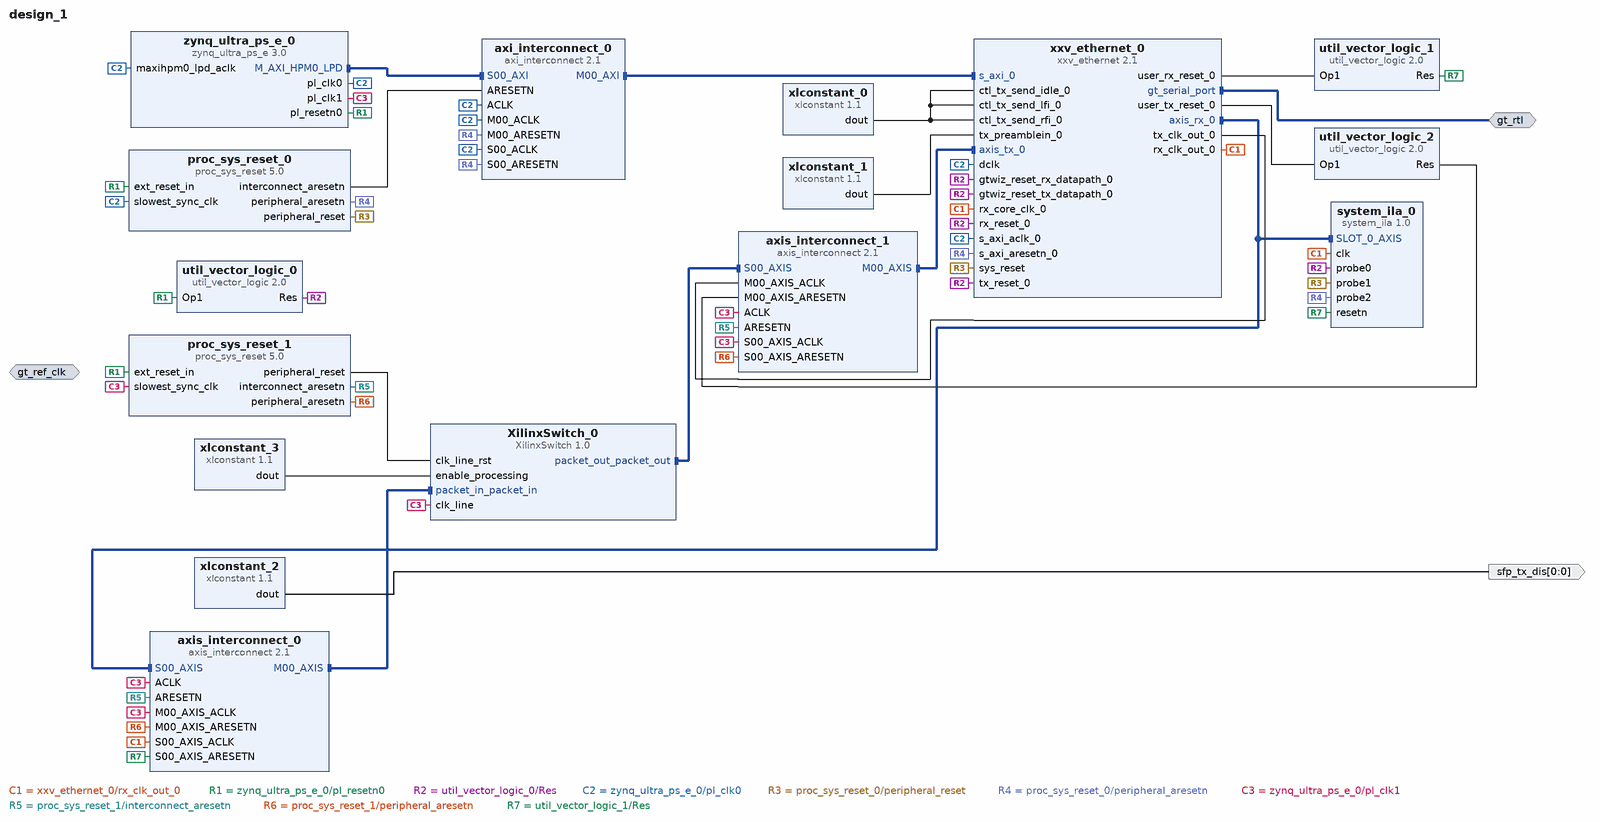
[diagram p0: block diagram of the top level]
# Vivado block design design_1, xczu9eg-ffvb1156-2-i, Vivado 2017.1_sdx
create_bd_design design_1

create_bd_intf_port -mode Master -vlnv xilinx.com:interface:gt_rtl:1.0 gt_rtl
create_bd_intf_port -mode Slave -vlnv xilinx.com:interface:diff_clock_rtl:1.0 gt_ref_clk
set_property -dict {CONFIG.FREQ_HZ 156250000} [get_bd_intf_ports gt_ref_clk]
create_bd_port -dir O -from 0 -to 0 sfp_tx_dis

create_bd_cell -type ip -vlnv xilinx.com:sdnet:XilinxSwitch:1.0 XilinxSwitch_0
create_bd_cell -type ip -vlnv xilinx.com:ip:xxv_ethernet:2.1 xxv_ethernet_0
set_property -dict [list \
  CONFIG.BASE_R_KR BASE-R \
  CONFIG.USE_BOARD_FLOW true \
  CONFIG.DIFFCLK_BOARD_INTERFACE user_si570_sysclk \
] [get_bd_cells xxv_ethernet_0]
create_bd_cell -type ip -vlnv xilinx.com:ip:xlconstant:1.1 xlconstant_0
set_property -dict {CONFIG.CONST_WIDTH 1 CONFIG.CONST_VAL 0} [get_bd_cells xlconstant_0]
create_bd_cell -type ip -vlnv xilinx.com:ip:zynq_ultra_ps_e:3.0 zynq_ultra_ps_e_0
set_property -dict {CONFIG.PSU__FPGA_PL1_ENABLE 1 CONFIG.PSU__CRL_APB__PL1_REF_CTRL__FREQMHZ 200} [get_bd_cells zynq_ultra_ps_e_0]
create_bd_cell -type ip -vlnv xilinx.com:ip:util_vector_logic:2.0 util_vector_logic_0
set_property -dict {CONFIG.C_SIZE 1 CONFIG.C_OPERATION not} [get_bd_cells util_vector_logic_0]
create_bd_cell -type ip -vlnv xilinx.com:ip:proc_sys_reset:5.0 proc_sys_reset_0
create_bd_cell -type ip -vlnv xilinx.com:ip:xlconstant:1.1 xlconstant_1
set_property -dict {CONFIG.CONST_WIDTH 56 CONFIG.CONST_VAL 0} [get_bd_cells xlconstant_1]
create_bd_cell -type ip -vlnv xilinx.com:ip:axis_interconnect:2.1 axis_interconnect_0
set_property -dict {CONFIG.NUM_MI 1} [get_bd_cells axis_interconnect_0]
create_bd_cell -type ip -vlnv xilinx.com:ip:axis_interconnect:2.1 axis_interconnect_1
set_property -dict {CONFIG.NUM_MI 1} [get_bd_cells axis_interconnect_1]
create_bd_cell -type ip -vlnv xilinx.com:ip:proc_sys_reset:5.0 proc_sys_reset_1
create_bd_cell -type ip -vlnv xilinx.com:ip:xlconstant:1.1 xlconstant_2
set_property -dict {CONFIG.CONST_VAL 0} [get_bd_cells xlconstant_2]
create_bd_cell -type ip -vlnv xilinx.com:ip:xlconstant:1.1 xlconstant_3
create_bd_cell -type ip -vlnv xilinx.com:ip:axi_interconnect:2.1 axi_interconnect_0
set_property -dict {CONFIG.NUM_MI 1} [get_bd_cells axi_interconnect_0]
create_bd_cell -type ip -vlnv xilinx.com:ip:util_vector_logic:2.0 util_vector_logic_1
set_property -dict {CONFIG.C_SIZE 1 CONFIG.C_OPERATION not} [get_bd_cells util_vector_logic_1]
create_bd_cell -type ip -vlnv xilinx.com:ip:util_vector_logic:2.0 util_vector_logic_2
set_property -dict {CONFIG.C_SIZE 1 CONFIG.C_OPERATION not} [get_bd_cells util_vector_logic_2]
create_bd_cell -type ip -vlnv xilinx.com:ip:system_ila:1.0 system_ila_0
set_property -dict [list \
  CONFIG.C_NUM_OF_PROBES 3 \
  CONFIG.C_SLOT_0_INTF_TYPE xilinx.com:interface:axis_rtl:1.0 \
  CONFIG.C_MON_TYPE MIX \
] [get_bd_cells system_ila_0]

# ---- connections ----

connect_bd_intf_net [get_bd_intf_pins XilinxSwitch_0/packet_in_packet_in] [get_bd_intf_pins axis_interconnect_0/M00_AXIS]
connect_bd_intf_net [get_bd_intf_pins axis_interconnect_0/S00_AXIS] [get_bd_intf_pins xxv_ethernet_0/axis_rx_0]
connect_bd_intf_net [get_bd_intf_pins axis_interconnect_0/S00_AXIS] [get_bd_intf_pins system_ila_0/SLOT_0_AXIS]
connect_bd_intf_net [get_bd_intf_pins axis_interconnect_1/M00_AXIS] [get_bd_intf_pins xxv_ethernet_0/axis_tx_0]
connect_bd_intf_net [get_bd_intf_pins XilinxSwitch_0/packet_out_packet_out] [get_bd_intf_pins axis_interconnect_1/S00_AXIS]
connect_bd_intf_net [get_bd_intf_pins axi_interconnect_0/M00_AXI] [get_bd_intf_pins xxv_ethernet_0/s_axi_0]
connect_bd_intf_net [get_bd_intf_pins zynq_ultra_ps_e_0/M_AXI_HPM0_LPD] [get_bd_intf_pins axi_interconnect_0/S00_AXI]
connect_bd_intf_net [get_bd_intf_ports gt_rtl] [get_bd_intf_pins xxv_ethernet_0/gt_serial_port]
connect_bd_net [get_bd_pins xlconstant_0/dout] \
  [get_bd_pins xxv_ethernet_0/ctl_tx_send_idle_0] [get_bd_pins xxv_ethernet_0/ctl_tx_send_lfi_0] \
  [get_bd_pins xxv_ethernet_0/ctl_tx_send_rfi_0]
connect_bd_net [get_bd_pins xxv_ethernet_0/rx_clk_out_0] \
  [get_bd_pins xxv_ethernet_0/rx_core_clk_0] [get_bd_pins system_ila_0/clk] [get_bd_pins axis_interconnect_0/S00_AXIS_ACLK]
connect_bd_net [get_bd_pins zynq_ultra_ps_e_0/pl_resetn0] \
  [get_bd_pins util_vector_logic_0/Op1] [get_bd_pins proc_sys_reset_0/ext_reset_in] \
  [get_bd_pins proc_sys_reset_1/ext_reset_in]
connect_bd_net [get_bd_pins util_vector_logic_0/Res] \
  [get_bd_pins xxv_ethernet_0/gtwiz_reset_tx_datapath_0] [get_bd_pins xxv_ethernet_0/gtwiz_reset_rx_datapath_0] \
  [get_bd_pins xxv_ethernet_0/rx_reset_0] [get_bd_pins xxv_ethernet_0/tx_reset_0] [get_bd_pins system_ila_0/probe0]
connect_bd_net [get_bd_pins zynq_ultra_ps_e_0/pl_clk0] \
  [get_bd_pins proc_sys_reset_0/slowest_sync_clk] [get_bd_pins xxv_ethernet_0/dclk] [get_bd_pins xxv_ethernet_0/s_axi_aclk_0] \
  [get_bd_pins zynq_ultra_ps_e_0/maxihpm0_lpd_aclk] [get_bd_pins axi_interconnect_0/ACLK] \
  [get_bd_pins axi_interconnect_0/S00_ACLK] [get_bd_pins axi_interconnect_0/M00_ACLK]
connect_bd_net [get_bd_pins proc_sys_reset_0/peripheral_reset] [get_bd_pins xxv_ethernet_0/sys_reset] [get_bd_pins system_ila_0/probe1]
connect_bd_net [get_bd_pins proc_sys_reset_0/peripheral_aresetn] \
  [get_bd_pins xxv_ethernet_0/s_axi_aresetn_0] [get_bd_pins system_ila_0/probe2] [get_bd_pins axi_interconnect_0/M00_ARESETN] \
  [get_bd_pins axi_interconnect_0/S00_ARESETN]
connect_bd_net [get_bd_pins xlconstant_1/dout] [get_bd_pins xxv_ethernet_0/tx_preamblein_0]
connect_bd_net -net M00_AXIS_ACLK_1 [get_bd_pins zynq_ultra_ps_e_0/pl_clk1] \
  [get_bd_pins XilinxSwitch_0/clk_line] [get_bd_pins proc_sys_reset_1/slowest_sync_clk] \
  [get_bd_pins axis_interconnect_0/M00_AXIS_ACLK] [get_bd_pins axis_interconnect_0/ACLK] \
  [get_bd_pins axis_interconnect_1/ACLK] [get_bd_pins axis_interconnect_1/S00_AXIS_ACLK]
connect_bd_net -net M00_AXIS_ACLK_2 [get_bd_pins xxv_ethernet_0/tx_clk_out_0] [get_bd_pins axis_interconnect_1/M00_AXIS_ACLK]
connect_bd_net [get_bd_pins proc_sys_reset_1/interconnect_aresetn] [get_bd_pins axis_interconnect_0/ARESETN] [get_bd_pins axis_interconnect_1/ARESETN]
connect_bd_net [get_bd_pins proc_sys_reset_1/peripheral_aresetn] \
  [get_bd_pins axis_interconnect_0/M00_AXIS_ARESETN] [get_bd_pins axis_interconnect_1/S00_AXIS_ARESETN]
connect_bd_net [get_bd_pins xlconstant_2/dout] [get_bd_ports sfp_tx_dis]
connect_bd_net [get_bd_pins xlconstant_3/dout] [get_bd_pins XilinxSwitch_0/enable_processing]
connect_bd_net -net ARESETN_1 [get_bd_pins proc_sys_reset_0/interconnect_aresetn] [get_bd_pins axi_interconnect_0/ARESETN]
connect_bd_net [get_bd_pins xxv_ethernet_0/user_rx_reset_0] [get_bd_pins util_vector_logic_1/Op1]
connect_bd_net [get_bd_pins util_vector_logic_1/Res] [get_bd_pins system_ila_0/resetn] [get_bd_pins axis_interconnect_0/S00_AXIS_ARESETN]
connect_bd_net -net M00_AXIS_ARESETN_1 [get_bd_pins util_vector_logic_2/Res] [get_bd_pins axis_interconnect_1/M00_AXIS_ARESETN]
connect_bd_net [get_bd_pins xxv_ethernet_0/user_tx_reset_0] [get_bd_pins util_vector_logic_2/Op1]
connect_bd_net [get_bd_pins proc_sys_reset_1/peripheral_reset] [get_bd_pins XilinxSwitch_0/clk_line_rst]

# ---- address map ----
assign_bd_address -offset 0x00080000000 -range 64K -target_address_space [get_bd_addr_spaces zynq_ultra_ps_e_0/Data] [get_bd_addr_segs xxv_ethernet_0/s_axi_0/Reg]

validate_bd_design
save_bd_design
